# EAGLE design left_switch_module (EAGLE 9.2.2)
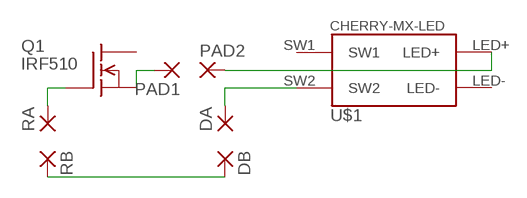
[diagram p0: schematic, sheet 1]

## Parts
DA  2,15/1,0  [2,15/1,0]
DB  2,15/1,0  [2,15/1,0]
PAD1  1,6/0,9  [1,6/0,9]
PAD2  1,6/0,9  [1,6/0,9]
Q1  IRF510  [TO220]
RA  2,15/1,0  [2,15/1,0]
RB  2,15/1,0  [2,15/1,0]
U$1  CHERRY-MX-LED  [CHERRY-MX-LED]

## Nets
N$1: Q1.1(G) RA.1(P)
N$2: DB.1(P) RB.1(P)
N$3: DA.1(P) U$1.SW2
N$4: PAD1.1(P) Q1.3(S)
N$5: PAD2.1(P) U$1.LED+
Unconnected: Q1.2(D) U$1.LED- U$1.SW1

## Library data of the parts
DA DB RA RB = wirepad:2,15/1,0: THROUGH-HOLE PAD
PAD1 PAD2 = wirepad:1,6/0,9: THROUGH-HOLE PAD
Q1 = transistor-fet:IRF510: N-Channel Enhancement MOSFET (HEXFET); 100V; 5,6A; 0,54Ohm
U$1 = cherrymx:CHERRY-MX-LED: Cherry MX series keyswitch with LED

## Board
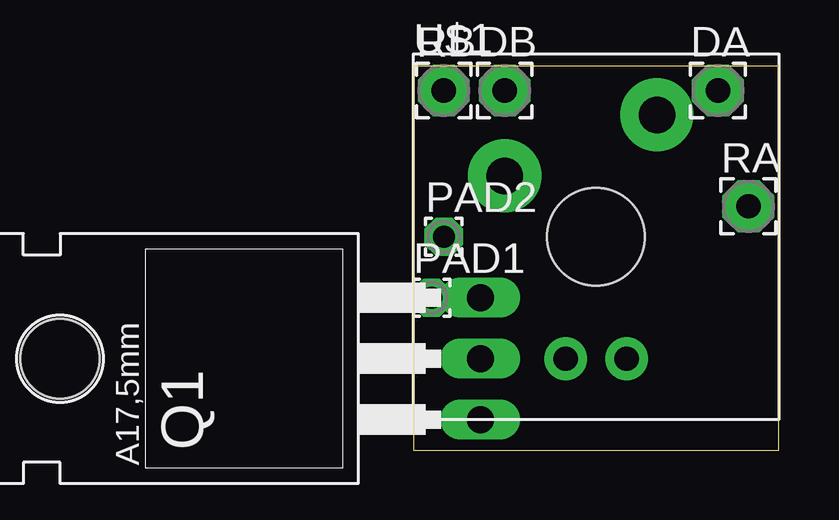
[diagram p1: board, top side]
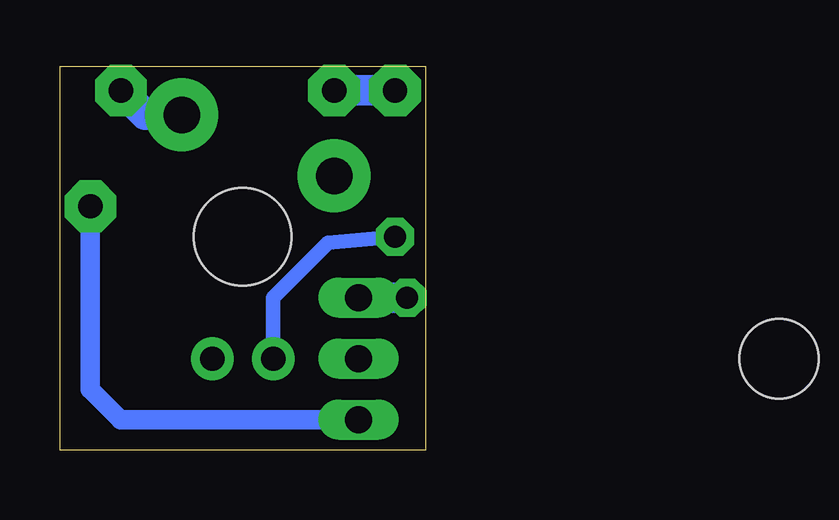
[diagram p2: board, bottom side, seen from below]

Size 15.24 x 16 mm. Coordinates in mm from the lower left corner, seen from the top.
Outline: 0,0 15.24,0 15.24,16 0,16 0,0
Copper layers (1*16): Top 0.035mm / dielectric 1.5mm / Bottom 0.035mm
Design rules "default": minimum track width 6mil, minimum drill 0.35mm, track to track 6mil, track to pad 6mil, pad to pad 6mil, via to via 6mil, smd to smd 6mil, copper to edge 40mil, drill to drill 6mil, minimum pad ring 10mil, minimum via ring 8mil, stop-mask expansion 4mil, vias tented up to drill 0mil, thermal gap 10mil

### Footprints (pad centres in the part's own frame; a part is rotated, then mirrored left to right if it is on the bottom)
2,15/1,0 = drill 1.016 pad 2.159 octagon: 1 0,0
1,6/0,9 = drill 0.914 pad 1.6 octagon: 1 0,0
TO220 = drill 1.118 long: 1 -2.54,-6.35; 2 0,-6.35; 3 2.54,-6.35 | hole 3.302: 0,11.176
CHERRY-MX-LED = drill 1.016 pad 1.778: LED+ -1.27,-5.08; LED- 1.27,-5.08 | drill 1.524 pad 3.048: SW1 -3.81,2.54; SW2 2.54,5.08 | hole 4.064: 0,0

### Placement (x,y rotation side)
DA  12.7,14.99 0 top
DB  3.81,14.99 0 top
PAD1  0.76,6.35 0 top
PAD2  1.27,8.89 0 top
Q1  -3.56,3.81 90 top
RA  13.97,10.16 0 top
RB  1.27,14.99 0 top
U$1  7.62,8.89 0 top

### Tracks (layer width: path | path; a pad name or v marks a point on that pad's centre or on a via)
N$1
  Bottom 0.813: RA.1 13.97,2.54 12.7,1.27 Q1.1
N$2
  Bottom 1.27: RB.1 DB.1
N$3
  Bottom 1.27: DA.1 11.68,13.97 U$1.SW2
N$4
  Bottom 1.27: Q1.3 PAD1.1
N$5
  Bottom 0.61: PAD2.1 4.06,8.64 6.35,6.35 U$1.LED+